# Altium project solar_chip.PrjPCB
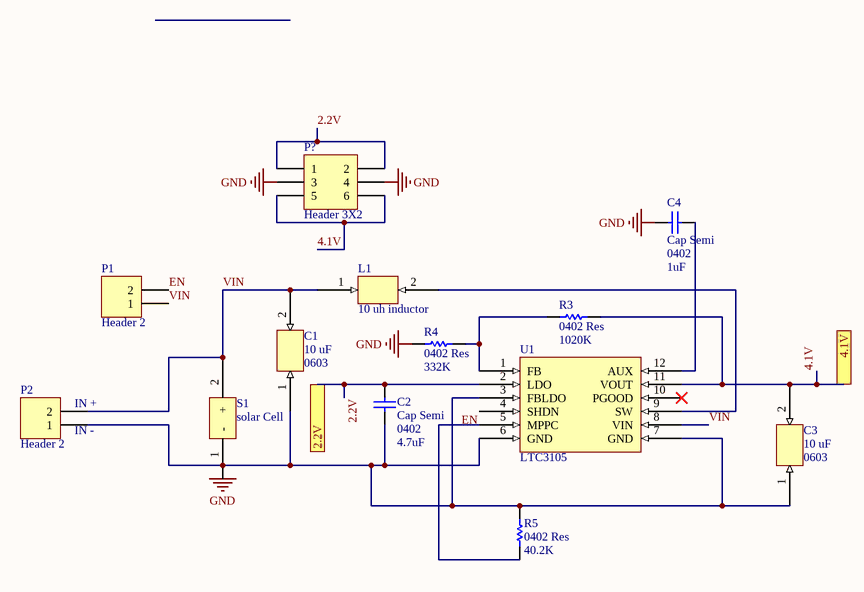
[diagram p0: Solar.SchDoc]
1 sheet, 13 parts. Net scope: flat (ports and power ports of the same name join across sheets).
Board file: solar_chip.PcbDoc

## Sheet Solar.SchDoc
size A

### Parts
C1  10 uF  Footprint: 0603  [CAP 10 uF]
C2  Cap Semi  value 4.7uF  [0402]
C3  10 uF  Footprint: 0603  [CAP 10 uF]
C4  Cap Semi  value 1uF  [0402]
L1  10 uh inductor  [INDC1411X12N]
P1  Header 2  [HDR1X2]
P2  Header 2  [HDR1X2]
P?  Header 3X2  [HDR2X3]
R3  0402 Res  value 1020K  [RESC1005X04N]
R4  0402 Res  value 332K  [RESC1005X04N]
R5  0402 Res  value 40.2K  [RESC1005X04N]
S1  solar Cell  [Solar_cell]
U1  LTC3105  [LTC3105]

### Ports
2.2V, 4.1V

### Nets
GND: C1.1 C2.2 C3.1 C4.2 P2.1 P?.3 P?.4 R4.1 R5.1 U1.3(FBLDO) U1.6(GND) U1.7(GND)
2.2V: C2.1 P?.1 P?.2 U1.2(LDO) ; port 2.2V
4.1V: C3.2 P?.5 P?.6 R3.2 U1.11(VOUT) ; port 4.1V
EN: P1.2 U1.4(SHDN)
VIN: C1.2 L1.1 P1.1 P2.2 S1.2(+) U1.8(VIN)
NetC4_1: C4.1 U1.12(AUX)
NetL1_2: L1.2 U1.9(SW)
NetR3_1: R3.1 R4.2 U1.1(FB)
NetR5_2: R5.2 U1.5(MPPC)

Not connected (* = marked no-connect by the designer): S1 1(-); U1 10(PGOOD)*

### Notes on the sheet
- (near P2) IN +
- (near P2) IN -

### Library data of the parts
C1 C3 = 10 uF: Value: 10uF
C2 C4 = Cap Semi: Capacitor (Semiconductor SIM Model); Published: 8-Jun-2000; LatestRevisionDate: 29-May-2009; LatestRevisionNote: IPC-7351 Footprint Added.; PackageReference: 0402; Publisher: Altium Limited; PackageDescription: Chip Capacitor
P1 P2 = Header 2: Header, 2-Pin; LatestRevisionDate: 17-Jul-2002; LatestRevisionNote: Re-released for DXP Platform.; Publisher: Altium Limited
P? = Header 3X2: Header, 3-Pin, Dual row; LatestRevisionDate: 17-Jul-2002; LatestRevisionNote: Re-released for DXP Platform.; Publisher: Altium Limited
S1 = sollar Cell